# Altium schematic sheet PROCESSOR_MEMORIES.SchDoc: Pin Swapping
size 431 x 279 mm; DocumentNumber: 3; SheetNumber: 3; SheetTotal: 5
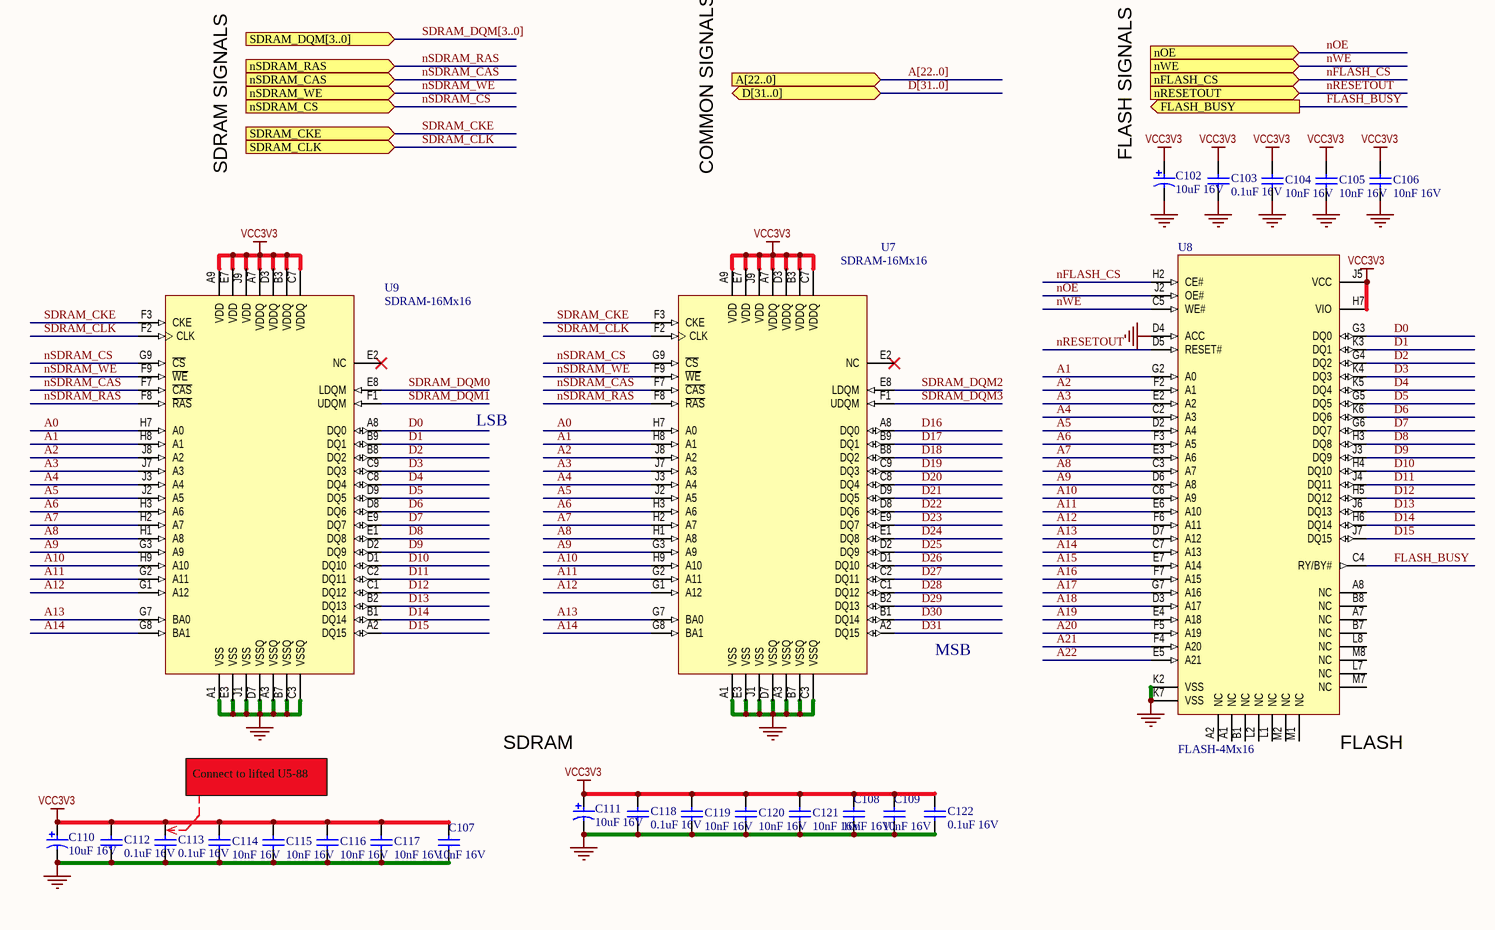
[diagram p0: PROCESSOR_MEMORIES.SchDoc]

## Parts
C102  10uF 16V  [CAPC3528]
C103  0.1uF 16V  [CAPC1005]
C104  10nF 16V  [CAPC1005]
C105  10nF 16V  [CAPC1005]
C106  10nF 16V  [CAPC1005]
C107  10nF 16V  [CAPC1005]
C108  10nF 16V  [CAPC1005]
C109  10nF 16V  [CAPC1005]
C110  10uF 16V  [CAPC3528]
C111  10uF 16V  [CAPC3528]
C112  0.1uF 16V  [CAPC1005]
C113  0.1uF 16V  [CAPC1005]
C114  10nF 16V  [CAPC1005]
C115  10nF 16V  [CAPC1005]
C116  10nF 16V  [CAPC1005]
C117  10nF 16V  [CAPC1005]
C118  0.1uF 16V  [CAPC1005]
C119  10nF 16V  [CAPC1005]
C120  10nF 16V  [CAPC1005]
C121  10nF 16V  [CAPC1005]
C122  0.1uF 16V  [CAPC1005]
U7  SDRAM-16Mx16  [BGA80P9X6-54]
U8  FLASH-4Mx16  [BGA80P12X8-63]
U9  SDRAM-16Mx16  [BGA80P9X6-54]

## Ports
A[22..0] (in), D[31..0] (bidir), FLASH_BUSY (out), nFLASH_CS (in), nOE (in), nRESETOUT (in), nSDRAM_CAS (in), nSDRAM_CS (in), nSDRAM_RAS (in), nSDRAM_WE (in), nWE (in), SDRAM_CKE (in), SDRAM_CLK (in), SDRAM_DQM[3..0] (in)

## Nets
GND: C102.2 C103.2 C104.2 C105.2 C106.2 C107.2 C108.2 C109.2 C110.2 C111.2 C112.2 C113.2 C114.2 C115.2 C116.2 C117.2 C118.2 C119.2 C120.2 C121.2 C122.2 U7.A1(VSS) U7.A3(VSSQ) U7.B7(VSSQ) U7.C3(VSSQ) U7.D7(VSSQ) U7.E3(VSS) U7.J1(VSS) U8.D4(ACC) U8.K2(VSS) U8.K7(VSS) U9.A1(VSS) U9.A3(VSSQ) U9.B7(VSSQ) U9.C3(VSSQ) U9.D7(VSSQ) U9.E3(VSS) U9.J1(VSS)
VCC3V3: C102.1 C103.1 C104.1 C105.1 C106.1 C107.1 C108.1 C109.1 C110.1 C111.1 C112.1 C113.1 C114.1 C115.1 C116.1 C117.1 C118.1 C119.1 C120.1 C121.1 C122.1 U7.A7(VDDQ) U7.A9(VDD) U7.B3(VDDQ) U7.C7(VDDQ) U7.D3(VDDQ) U7.E7(VDD) U7.J9(VDD) U8.H7(VIO) U8.J5(VCC) U9.A7(VDDQ) U9.A9(VDD) U9.B3(VDDQ) U9.C7(VDDQ) U9.D3(VDDQ) U9.E7(VDD) U9.J9(VDD)
A0: U7.H7(A0) U9.H7(A0)
A1: U7.H8(A1) U8.G2(A0) U9.H8(A1)
A2: U7.J8(A2) U8.F2(A1) U9.J8(A2)
A3: U7.J7(A3) U8.E2(A2) U9.J7(A3)
A4: U7.J3(A4) U8.C2(A3) U9.J3(A4)
A5: U7.J2(A5) U8.D2(A4) U9.J2(A5)
A6: U7.H3(A6) U8.F3(A5) U9.H3(A6)
A7: U7.H2(A7) U8.E3(A6) U9.H2(A7)
A8: U7.H1(A8) U8.C3(A7) U9.H1(A8)
A9: U7.G3(A9) U8.D6(A8) U9.G3(A9)
A10: U7.H9(A10) U8.C6(A9) U9.H9(A10)
A11: U7.G2(A11) U8.E6(A10) U9.G2(A11)
A12: U7.G1(A12) U8.F6(A11) U9.G1(A12)
A13: U7.G7(BA0) U8.D7(A12) U9.G7(BA0)
A14: U7.G8(BA1) U8.C7(A13) U9.G8(BA1)
A15: U8.E7(A14)
A16: U8.F7(A15)
A17: U8.G7(A16)
A18: U8.D3(A17)
A19: U8.E4(A18)
A20: U8.F5(A19)
A21: U8.F4(A20)
A22: U8.E5(A21)
D0: U8.G3(DQ0) U9.A8(DQ0)
D1: U8.K3(DQ1) U9.B9(DQ1)
D2: U8.G4(DQ2) U9.B8(DQ2)
D3: U8.K4(DQ3) U9.C9(DQ3)
D4: U8.K5(DQ4) U9.C8(DQ4)
D5: U8.G5(DQ5) U9.D9(DQ5)
D6: U8.K6(DQ6) U9.D8(DQ6)
D7: U8.G6(DQ7) U9.E9(DQ7)
D8: U8.H3(DQ8) U9.E1(DQ8)
D9: U8.J3(DQ9) U9.D2(DQ9)
D10: U8.H4(DQ10) U9.D1(DQ10)
D11: U8.J4(DQ11) U9.C2(DQ11)
D12: U8.H5(DQ12) U9.C1(DQ12)
D13: U8.J6(DQ13) U9.B2(DQ13)
D14: U8.H6(DQ14) U9.B1(DQ14)
D15: U8.J7(DQ15) U9.A2(DQ15)
D16: U7.A8(DQ0)
D17: U7.B9(DQ1)
D18: U7.B8(DQ2)
D19: U7.C9(DQ3)
D20: U7.C8(DQ4)
D21: U7.D9(DQ5)
D22: U7.D8(DQ6)
D23: U7.E9(DQ7)
D24: U7.E1(DQ8)
D25: U7.D2(DQ9)
D26: U7.D1(DQ10)
D27: U7.C2(DQ11)
D28: U7.C1(DQ12)
D29: U7.B2(DQ13)
D30: U7.B1(DQ14)
D31: U7.A2(DQ15)
FLASH_BUSY: U8.C4(RY/BY#) ; port FLASH_BUSY
nFLASH_CS: U8.H2(CE#) ; port nFLASH_CS
nOE: U8.J2(OE#) ; port nOE
nRESETOUT: U8.D5(RESET#) ; port nRESETOUT
nSDRAM_CAS: U7.F7(~{CAS}) U9.F7(~{CAS}) ; port nSDRAM_CAS
nSDRAM_CS: U7.G9(~{CS}) U9.G9(~{CS}) ; port nSDRAM_CS
nSDRAM_RAS: U7.F8(~{RAS}) U9.F8(~{RAS}) ; port nSDRAM_RAS
nSDRAM_WE: U7.F9(~{WE}) U9.F9(~{WE}) ; port nSDRAM_WE
nWE: U8.C5(WE#) ; port nWE
SDRAM_CKE: U7.F3(CKE) U9.F3(CKE) ; port SDRAM_CKE
SDRAM_CLK: U7.F2(CLK) U9.F2(CLK) ; port SDRAM_CLK
SDRAM_DQM0: U9.E8(LDQM)
SDRAM_DQM1: U9.F1(UDQM)
SDRAM_DQM2: U7.E8(LDQM)
SDRAM_DQM3: U7.F1(UDQM)

Not connected (* = marked no-connect by the designer): U7 E2(NC)*; U8 A1(NC) A2(NC) A7(NC) A8(NC) B1(NC) B7(NC) B8(NC) L1(NC) L2(NC) L7(NC) L8(NC) M1(NC) M2(NC) M7(NC) M8(NC); U9 E2(NC)*

## Buses and harness runs
bus A[22..0] = port A[22..0]
bus D[31..0] = port D[31..0]
bus SDRAM_DQM[3..0] = port SDRAM_DQM[3..0]

## Notes on the sheet
- SDRAM SIGNALS
- COMMON SIGNALS
- (near C102) FLASH SIGNALS
- LSB
- MSB
- Connect to lifted U5-88
- SDRAM
- (near U8) FLASH
- 8
- 7
- 6
- 5
- 4
- 3
- DWG. NO.
- REV.
- SHT.
- 2
- 1
- THIS DOCUMENT AND THE DATA DISCLOSED HEREIN OR HEREWITH IS THE PROPERTY OF ALTIUM LIMITED AND MAY BE FREELY DISTRIBUTED IN WHOLE. NO RIGHTS ARE RESERVED OR EXPRESS OR IMPLIED WARANTEE GIVEN.
- REVISION
- DESCRIPTION
- DATE
- APPROVED
- F
- E
- D
- C
- B
- A
- TITLE
- SCALE:
- SIZE
- CAGE CODE
- FILE NAME
- DWG NO.
- SHEET
- OF
- REV

## Library data of the parts
C102 C110 C111 = CAP-P: Polar Capacitor; Design Item Id: CAP-P-10uF-16V-MCCT-B
C103-C109 C112-C122 = CAP-NP: Capacitor
  C103 C112 C113 C118 C122: Design Item Id: CAP-NP-0.1uF-16V-0402
  C104-C109 C114-C117 C119-C121: Design Item Id: CAP-NP-10nF-16V-0402
U7 U9 = MT48LC16M16A2FG: 256Mb Synchronous High-Speed CMOS DRAM, 16Mb x 16Bit x 4 Banks, 54-Ball FPGA, Commercial; Design Item Id: MEM-SDRAM-16Mx16-BGA54
U8 = AM29LV640DU90RWHI: 64 Mb (4 M x 16) CMOS 3.0 Volt, Uniform Sector Flash Memory with VersatileI/O Control, 63-ball FBGA, Industrial Grade; Design Item Id: MEM-FLASH-P-4Mx16-BGA63